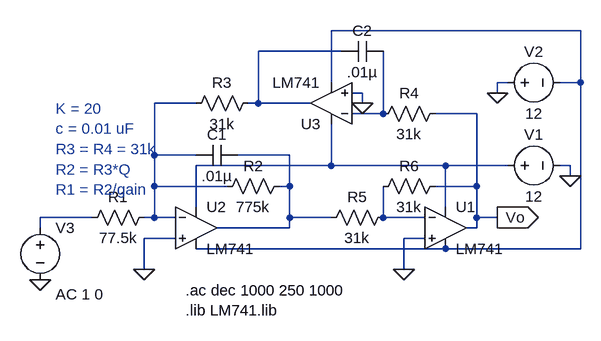
[diagram p0: schematic q7.asc]
q7.asc, the LTspice schematic file:
Version 4
SHEET 1 880 680
WIRE 800 -48 416 -48
WIRE 432 -16 304 -16
WIRE 416 32 416 -48
WIRE 688 32 672 32
WIRE 800 32 800 -48
WIRE 800 32 768 32
WIRE 464 48 448 48
WIRE 672 48 672 32
WIRE 208 64 144 64
WIRE 304 64 304 -16
WIRE 304 64 288 64
WIRE 384 64 304 64
WIRE 464 64 464 48
WIRE 496 80 496 -16
WIRE 496 80 448 80
WIRE 640 80 576 80
WIRE 144 144 144 64
WIRE 208 144 144 144
WIRE 352 144 272 144
WIRE 416 160 416 96
WIRE 416 160 208 160
WIRE 592 160 416 160
WIRE 688 160 592 160
WIRE 784 160 768 160
WIRE 784 176 784 160
WIRE 144 192 144 144
WIRE 256 192 144 192
WIRE 352 192 352 144
WIRE 352 192 336 192
WIRE 640 192 640 80
WIRE 640 192 576 192
WIRE 208 224 208 160
WIRE 592 224 592 160
WIRE 48 240 -32 240
WIRE 144 240 144 192
WIRE 144 240 128 240
WIRE 176 240 144 240
WIRE 352 240 352 192
WIRE 416 240 352 240
WIRE 496 240 496 192
WIRE 560 240 496 240
WIRE 640 240 640 192
WIRE 672 240 640 240
WIRE -32 256 -32 240
WIRE 352 256 352 240
WIRE 352 256 240 256
WIRE 640 256 640 240
WIRE 640 256 624 256
WIRE 176 272 128 272
WIRE 560 272 528 272
WIRE 592 288 208 288
WIRE 800 288 800 32
WIRE 800 288 592 288
WIRE 128 320 128 272
WIRE 528 320 528 272
FLAG 784 176 0
FLAG 672 48 0
FLAG 528 320 0
FLAG 128 320 0
FLAG 464 64 0
FLAG -32 336 0
FLAG 672 240 Vo
IOPIN 672 240 Out
SYMBOL LM741 592 192 R0
SYMATTR InstName U1
SYMBOL LM741 208 192 R0
SYMATTR InstName U2
SYMBOL LM741 416 128 R180
SYMATTR InstName U3
SYMBOL voltage 672 160 R270
WINDOW 0 32 56 VTop 2
WINDOW 3 -32 56 VBottom 2
SYMATTR InstName V1
SYMATTR Value 12
SYMBOL voltage 672 32 R270
WINDOW 0 32 56 VTop 2
WINDOW 3 -32 56 VBottom 2
SYMATTR InstName V2
SYMATTR Value 12
SYMBOL res 144 224 R90
WINDOW 0 0 56 VBottom 2
WINDOW 3 32 56 VTop 2
SYMATTR InstName R1
SYMATTR Value 77.5k
SYMBOL res 352 176 R90
WINDOW 0 0 56 VBottom 2
WINDOW 3 32 56 VTop 2
SYMATTR InstName R2
SYMATTR Value 775k
SYMBOL res 304 48 R90
WINDOW 0 0 56 VBottom 2
WINDOW 3 32 56 VTop 2
SYMATTR InstName R3
SYMATTR Value 31k
SYMBOL res 592 64 R90
WINDOW 0 0 56 VBottom 2
WINDOW 3 32 56 VTop 2
SYMATTR InstName R4
SYMATTR Value 31k
SYMBOL res 512 224 R90
WINDOW 0 0 56 VBottom 2
WINDOW 3 32 56 VTop 2
SYMATTR InstName R5
SYMATTR Value 31k
SYMBOL res 592 176 R90
WINDOW 0 0 56 VBottom 2
WINDOW 3 32 56 VTop 2
SYMATTR InstName R6
SYMATTR Value 31k
SYMBOL cap 272 128 R90
WINDOW 0 0 32 VBottom 2
WINDOW 3 32 32 VTop 2
SYMATTR InstName C1
SYMATTR Value .01µ
SYMBOL cap 496 -32 R90
WINDOW 0 0 32 VBottom 2
WINDOW 3 32 32 VTop 2
SYMATTR InstName C2
SYMATTR Value .01µ
SYMBOL voltage -32 240 R0
WINDOW 123 24 118 Left 2
SYMATTR InstName V3
SYMATTR Value ""
SYMATTR Value2 AC 1 0
TEXT -8 72 Left 2 ;K = 20\nc = 0.01 uF\nR3 = R4 = 31k\nR2 = R3*Q\nR1 = R2/gain
TEXT 192 352 Left 2 !.ac dec 1000 250 1000\n.lib LM741.lib

The netlist it stands for:
* q7.asc
XU1 0 N008 N006 N001 Vo LM741  ; pins In+ In- V+ V- OUT
XU2 0 N003 N006 N001 N005 LM741  ; pins In+ In- V+ V- OUT
XU3 0 N004 N006 N001 N002 LM741  ; pins In+ In- V+ V- OUT
V1 N006 0 12
V2 0 N001 12
R1 N003 N007 77.5k
R2 N005 N003 775k
R3 N002 N003 31k
R4 Vo N004 31k
R5 N008 N005 31k
R6 Vo N008 31k
C1 N005 N003 .01µ
C2 N004 N002 .01µ
V3 N007 0 AC 1 0
* K = 20
* c = 0.01 uF
* R3 = R4 = 31k
* R2 = R3*Q
* R1 = R2/gain
.ac dec 1000 250 1000
.lib LM741.lib
.lib LM741.lib
.backanno
.end